# EAGLE design 6DOF (EAGLE 9.6.2)
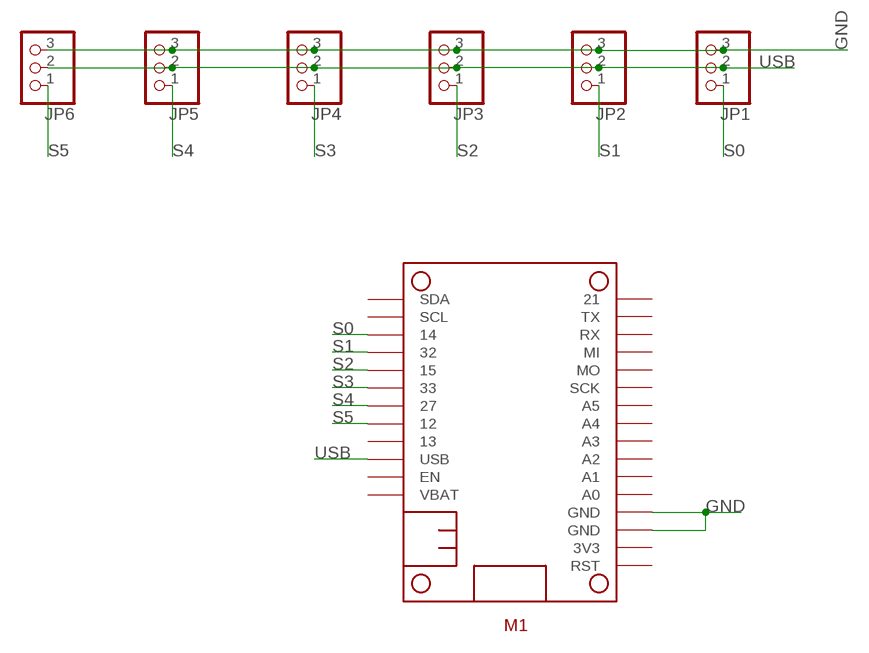
[diagram p0: schematic, sheet 1]

## Parts
JP1  PINHD-1X3  [1X03]
JP2  PINHD-1X3  [1X03]
JP3  PINHD-1X3  [1X03]
JP4  PINHD-1X3  [1X03]
JP5  PINHD-1X3  [1X03]
JP6  PINHD-1X3  [1X03]
M1  RARNDT-MISCELANEOUS_FEATHERBOARD_ESP32FETHERWING_DIM_ESP32  [RARNDT-MISCELANEOUS_FEATHERBOARD_ESP32]

## Nets
GND: JP1.3 JP2.3 JP3.3 JP4.3 JP5.3 JP6.3 M1.3(GND) M1.4(GND)
S0: JP1.1 M1.19
S1: JP2.1 M1.20
S2: JP3.1 M1.21
S3: JP4.1 M1.22
S4: JP5.1 M1.23
S5: JP6.1 M1.24
USB: JP1.2 JP2.2 JP3.2 JP4.2 JP5.2 JP6.2 M1.26(USB)
Unconnected: M1.1(RST) M1.2(3V3) M1.5(A0) M1.6(A1) M1.7(A2) M1.8(A3) M1.9(A4) M1.10(A5) M1.11(SCK) M1.12(MO) M1.13(MI) M1.14(RX) M1.15(TX) M1.16 M1.17(SDA) M1.18(SCL) M1.25 M1.27(EN) M1.28(VBAT)

## Library data of the parts
JP1-JP6 = pinhead:PINHD-1X3: PIN HEADER
M1 = FeatherESP32:RARNDT-MISCELANEOUS_FEATHERBOARD_ESP32

## Board
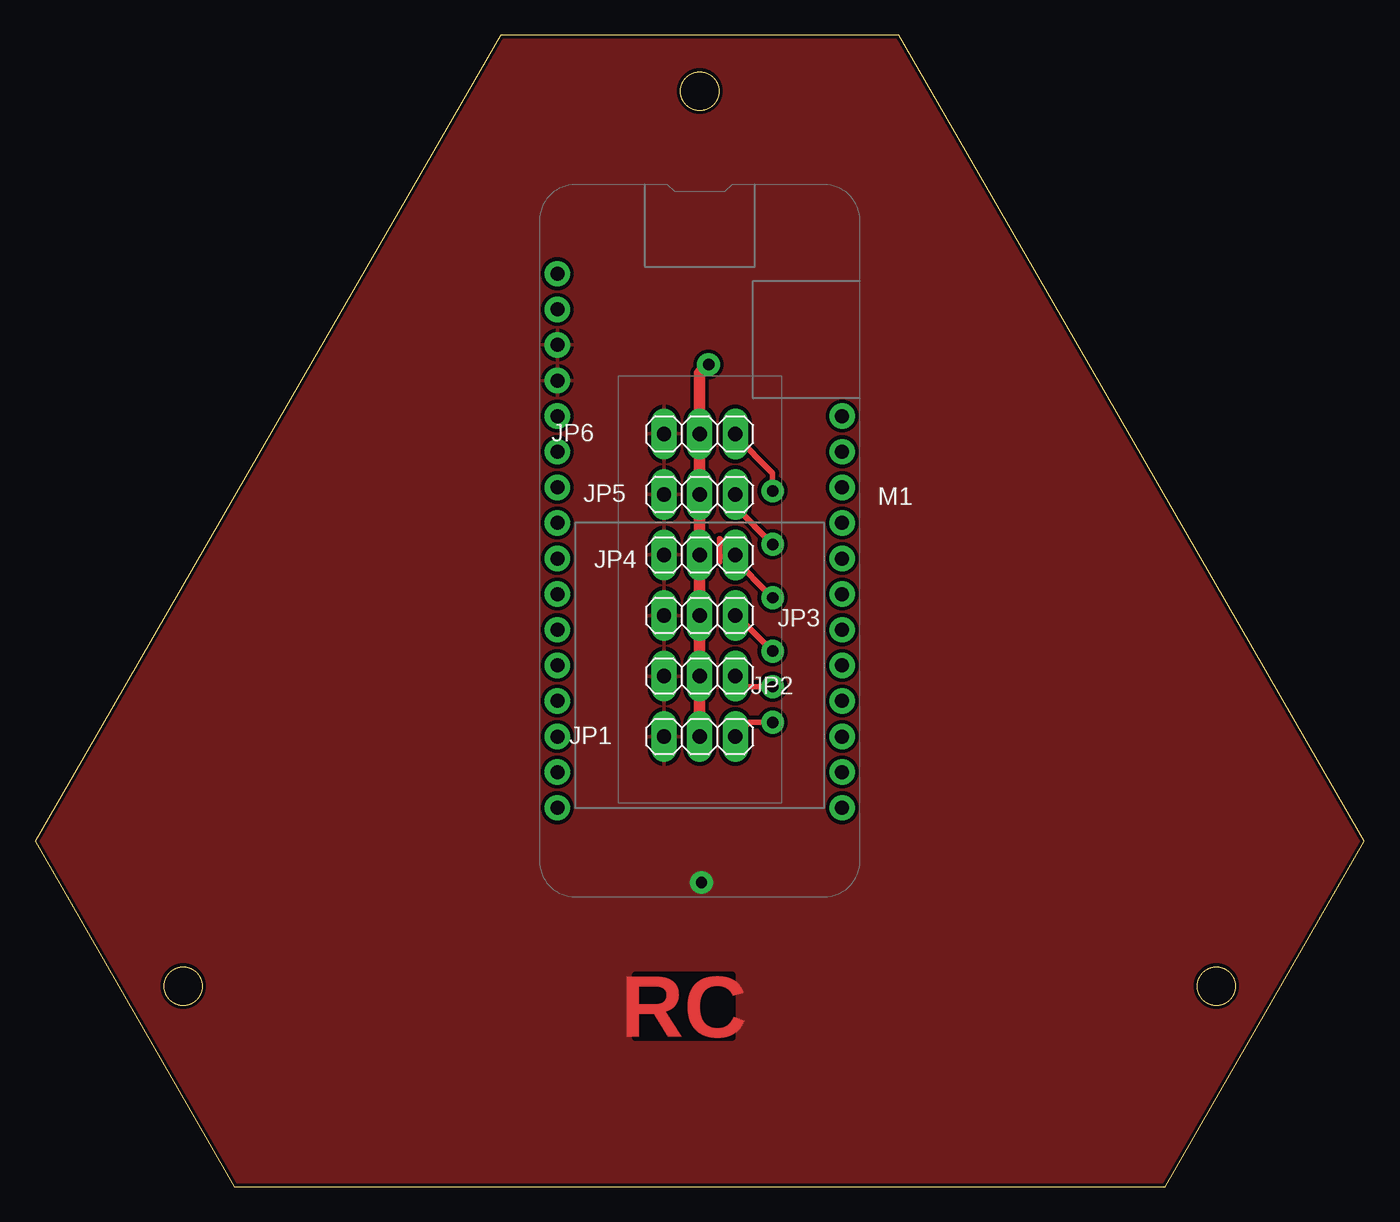
[diagram p1: board, top side]
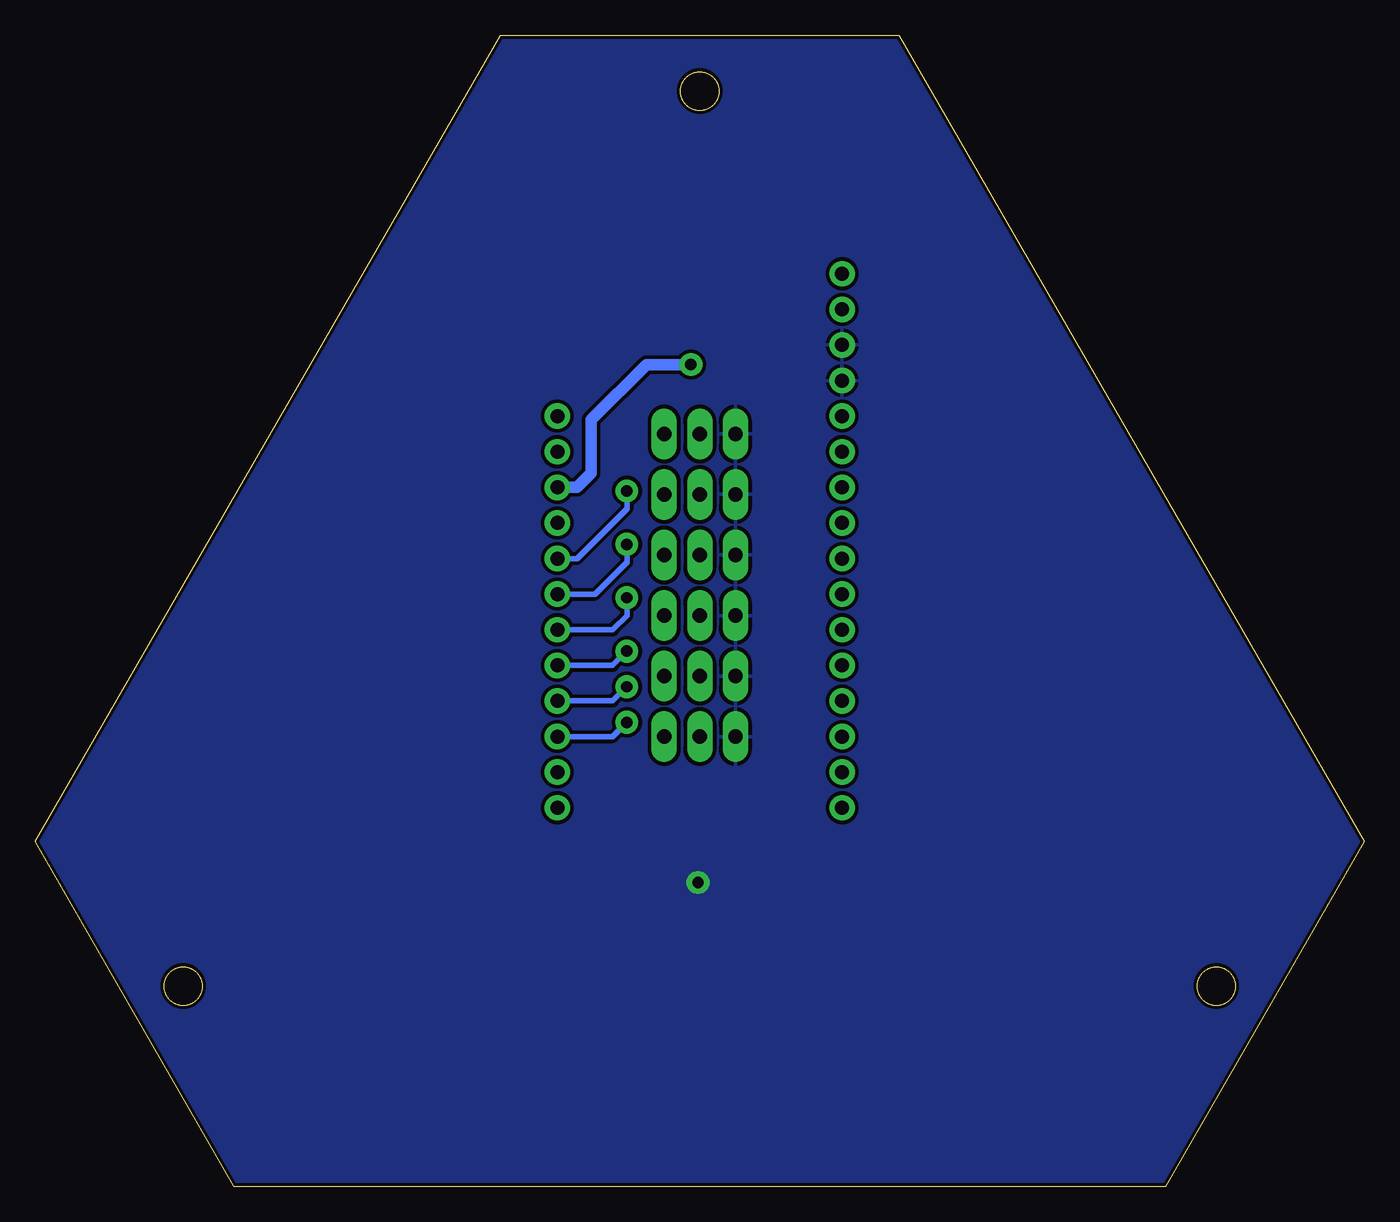
[diagram p2: board, bottom side, seen from below]

Size 94.89 x 82.17 mm. Coordinates in mm from the lower left corner, seen from the top.
Outline: 61.67,82.17 33.22,82.17 0,24.64 14.23,0 80.66,0 94.89,24.64 61.67,82.17
Outline: circle at 10.58,14.32 radius 1.36
Outline: circle at 84.31,14.32 radius 1.36
Outline: circle at 47.44,78.17 radius 1.36
Copper layers (1*16): Top 0.035mm / dielectric 1.5mm / Bottom 0.035mm
Design rules "fablab_lpkf": minimum track width 16mil, minimum drill 32mil, track to track 10mil, track to pad 10mil, pad to pad 10mil, via to via 10mil, smd to smd 10mil, copper to edge 10mil, drill to drill 10mil, minimum pad ring 16mil, minimum via ring 16mil, stop-mask expansion 4mil, vias tented up to drill 0mil, thermal gap 10mil

### Footprints (pad centres in the part's own frame; a part is rotated, then mirrored left to right if it is on the bottom)
1X03 = drill 1.016 long: 1 -2.54,0; 2 0,0; 3 2.54,0
RARNDT-MISCELANEOUS_FEATHERBOARD_ESP32 = drill 1: 1 -19.05,-10.16; 2 -16.51,-10.16; 3 -13.97,-10.16; 4 -11.43,-10.16; 5 -8.89,-10.16; 6 -6.35,-10.16; 7 -3.81,-10.16; 8 -1.27,-10.16; 9 1.27,-10.16; 10 3.81,-10.16; 11 6.35,-10.16; 12 8.89,-10.16; 13 11.43,-10.16; 14 13.97,-10.16; 15 16.51,-10.16; 16 19.05,-10.16; 17 19.05,10.16; 18 16.51,10.16; 19 13.97,10.16; 20 11.43,10.16; 21 8.89,10.16; 22 6.35,10.16; 23 3.81,10.16; 24 1.27,10.16; 25 -1.27,10.16; 26 -3.81,10.16; 27 -6.35,10.16; 28 -8.89,10.16

### Placement (x,y rotation side)
JP1  47.44,32.12 180 top
JP2  47.44,36.44 180 top
JP3  47.44,40.76 180 top
JP4  47.44,45.08 180 top
JP5  47.44,49.39 180 top
JP6  47.44,53.71 180 top
M1  47.44,46.09 270 top

### Tracks (layer width: path | path; a pad name or v marks a point on that pad's centre or on a via)
GND  (via drill 0.81)
  other vias: 47.57,21.71
  pour Top: -4.5,87.11 100.91,87.11 100.91,-8.14 -4.5,-8.14
  pour Bottom: -7.04,89.65 104.72,89.65 104.72,-10.68 -7.04,-10.68
S0  (via drill 0.81)
  Top 0.406: v52.65,33.14 51,33.14 JP1.1
  Bottom 0.406: M1.19 53.66,32.12 v52.65,33.14
S1  (via drill 0.81)
  Top 0.406: v52.65,35.68 50.74,35.68 JP2.1
  Bottom 0.406: M1.20 53.66,34.66 v52.65,35.68
S2  (via drill 0.81)
  Top 0.406: v52.65,38.22 50.11,40.76 JP3.1
  Bottom 0.406: M1.21 53.66,37.2 v52.65,38.22
S3  (via drill 0.81)
  Top 0.406: JP4.1 48.84,46.22 48.84,44.95 | 48.84,44.95 48.84,44.57 | v52.65,42.03 49.73,44.95 48.84,44.95
  Bottom 0.406: M1.22 53.66,39.74 52.65,40.76 v52.65,42.03
S4  (via drill 0.81)
  Top 0.406: v52.65,45.84 49.98,48.51 JP5.1
  Bottom 0.406: M1.23 54.93,42.28 52.65,44.57 v52.65,45.84
S5  (via drill 0.81)
  Top 0.406: v52.65,49.65 52.65,50.92 49.98,53.59 JP6.1
  Bottom 0.406: M1.24 56.2,44.82 52.65,48.38 v52.65,49.65
USB  (via drill 0.81)
  Top 0.813: v48.08,58.67 47.44,58.03 JP6.2 JP5.2 JP4.2 JP3.2 JP2.2 JP1.2
  Bottom 0.813: v48.08,58.67 51.25,58.67 55.19,54.73 55.19,50.92 56.2,49.9 M1.26

### Text on the board
Top: RC